# EasyEDA Pro project ProPrj_BrainStimulator-4Channels-Prototype_2025-12-16.epro, board PCB1
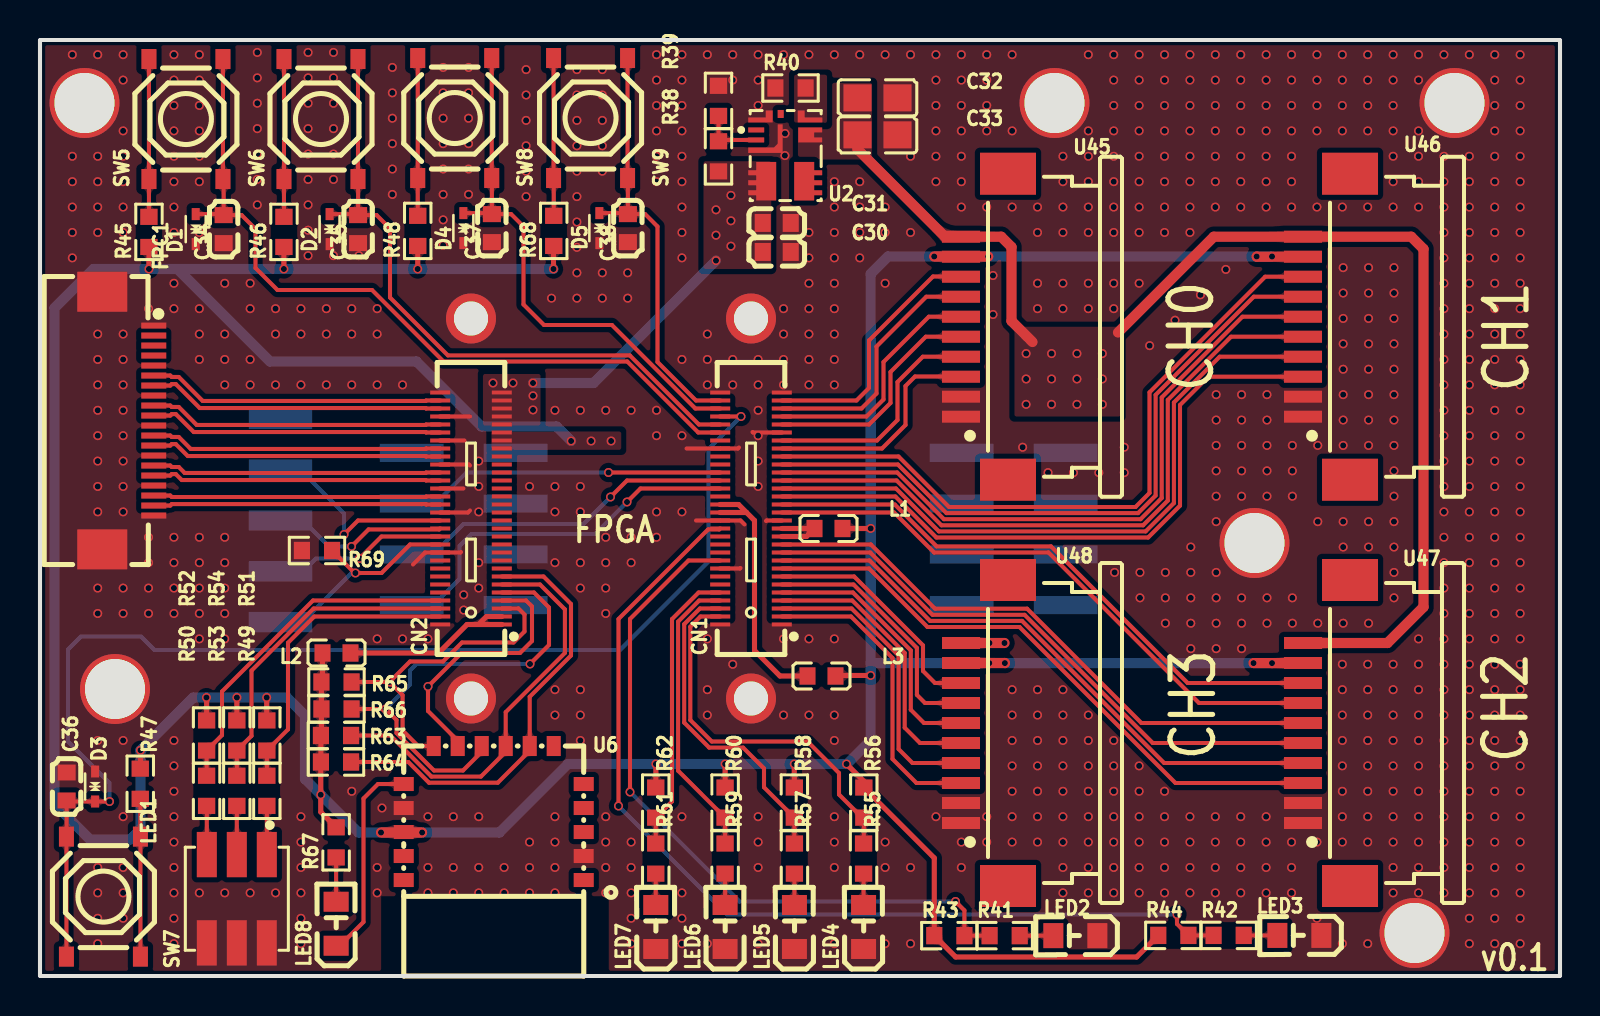
[diagram p5: board, top side]
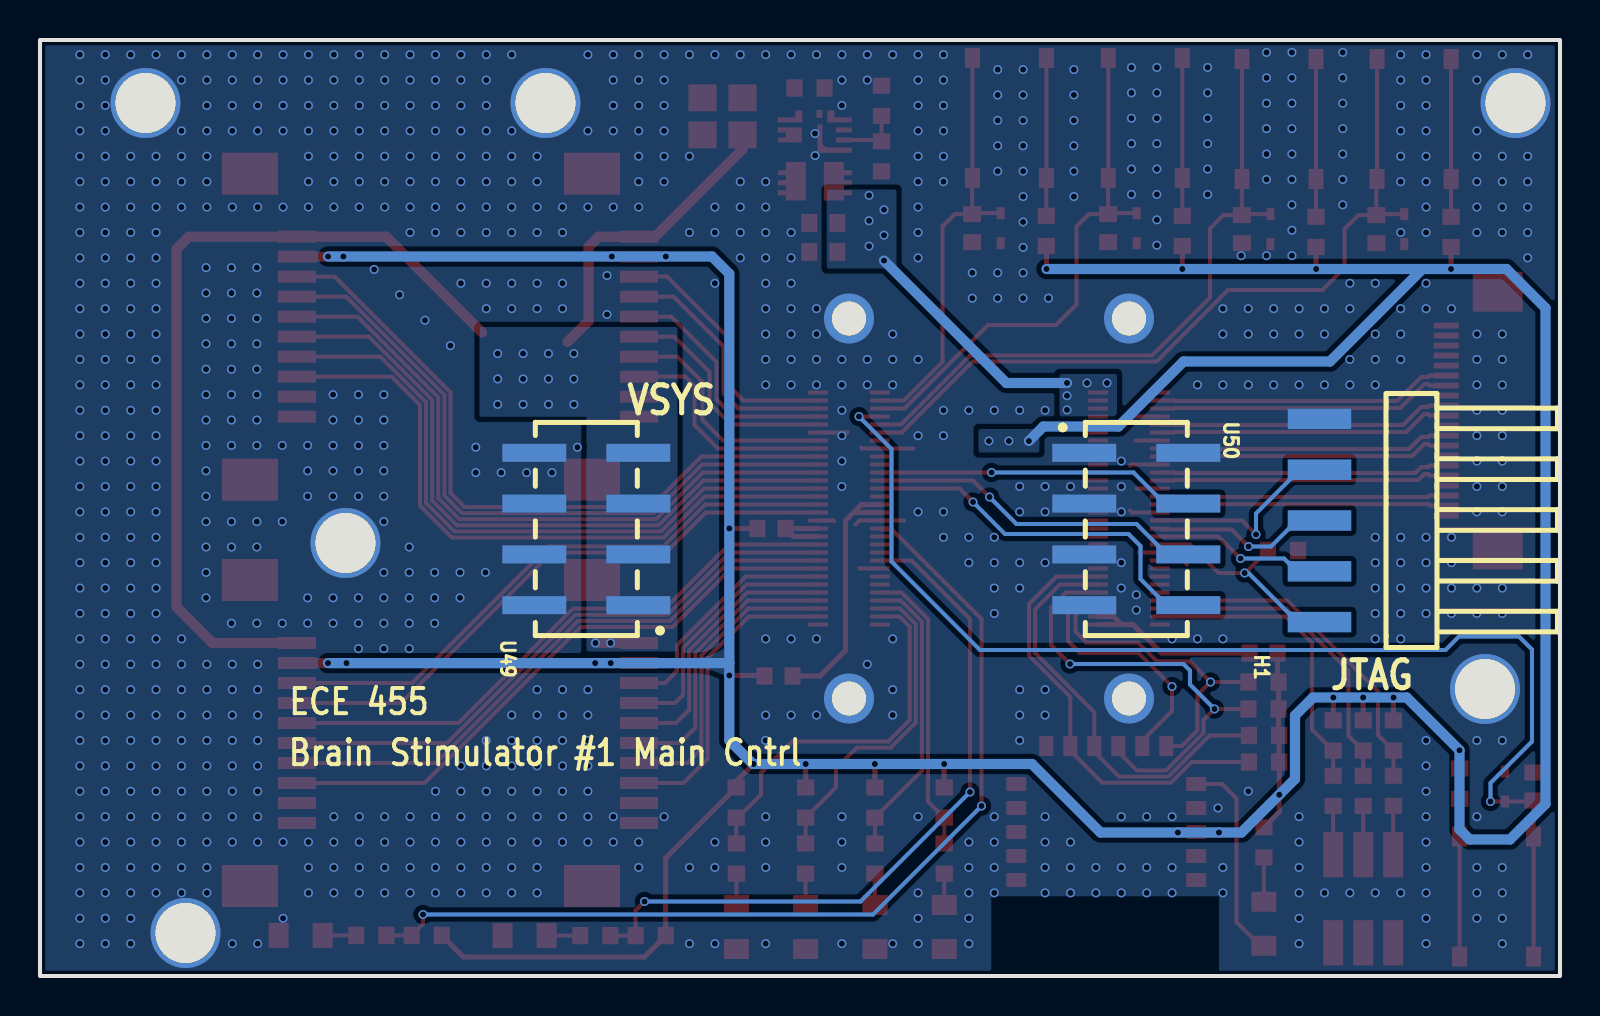
[diagram p6: board, bottom side, seen from below]

Outline 76 x 46.8 mm; copper layers: Top Layer, Inner1, Inner2, Bottom Layer. Coordinates in mm from the lower left corner of the outline.
Outline path: rectangle 0,46.8 76,0
Stack: Top Layer 0.035mm Outer layer thickness 1oz / Dielectric1 0.2104mm 7628 RC49% 8.6mil / Inner1 0.0152mm Inner layer thickness / Dielectric2 1.065mm 1.1mm H/HOZ Copper / Inner2 0.0152mm Inner layer thickness / Dielectric3 0.2104mm 7628 RC49% 8.6mil / Bottom Layer 0.035mm Outer layer thickness 1oz

## Design rules (mm)
net M0_D3_P: M0_D3_
net M0_D3_N: M0_D3_
net M0_D2_P: M0_D2_
net M0_D2_N: M0_D2_
net M0_CK_P: M0_CK_
net M0_CK_N: M0_CK_
net M0_D1_P: M0_D1_
net M0_D1_N: M0_D1_
net M0_D0_P: M0_D0_
net M0_D0_N: M0_D0_
spacing copperThickness1oz (default): track to track 0.102, other pairs 0.152 to 0.3
spacing copperThickness2oz: track to track 0.203, other pairs 0.152 to 0.3
track width copperThickness1oz (default): min 0.127, default 0.254, max 2.54
track width copperThickness2oz: min 0.203, default 0.254, max 2.54
differential pair differentialPair (default): width min 0.127, default 0.254, max 2.54; gap min 0.152, default 0.152
net +5V uses copperRegion1
net GND uses copperRegion1
net VSYS uses copperRegion1
net 3V3 uses copperRegion1
net $1N10 uses copperRegion
net $1N5 uses copperRegion1
pour e532 uses copperRegion1, default

## Placement (name value [footprint] x y rotation side)
C30  22uF  [C0603]  36.84 36.2 180 top
C31  22uF  [C0603]  36.84 37.65 180 top
C32  10uF  [C0805]  41.88 43.91 180 top
C33  100nF  [C0805]  41.88 42.06 180 top
C34  100nF  [C0603]  9.18 37.34 90 top
C35  100nF  [C0603]  15.91 37.34 90 top
C36  100nF  [C0603]  1.33 9.48 270 top
C37  100nF  [C0603]  22.59 37.39 90 top
C38  100nF  [C0603]  29.39 37.39 90 top
CN1  DF40C-60DS-0.4V(51)  [CONN-SMD_DF40C-60DS-0.4V-51]  35.55 23.38 90 top
CN2  DF40C-60DS-0.4V(51)  [CONN-SMD_DF40C-60DS-0.4V-51]  21.55 23.38 90 top
D1  RSB6.8SMT2N  [SOD-523_L1.2-W0.8-LS1.6-BI]  7.79 37.34 90 top
D2  RSB6.8SMT2N  [SOD-523_L1.2-W0.8-LS1.6-BI]  14.48 37.34 90 top
D3  RSB6.8SMT2N  [SOD-523_L1.2-W0.8-LS1.6-BI]  2.76 9.48 270 top
D4  RSB6.8SMT2N  [SOD-523_L1.2-W0.8-LS1.6-BI]  21.17 37.39 90 top
D5  RSB6.8SMT2N  [SOD-523_L1.2-W0.8-LS1.6-BI]  27.97 37.39 90 top
FPC1  FPC-05F-20PH20  [FPC-SMD_20P-P0.50_XUNPU_FPC-05F-20PH20]  4.4 27.77 270 top
H1  HX PZ2.54-1x5P WT  [HDR-SMD_5P-P2.54-H-M-W12.8-N]  12.02 22.78 90 bottom
L1  PZ1608D300-3R0TF  [L0603]  39.42 22.38 180 top
L2  PZ1608D300-3R0TF  [L0603]  14.82 16.15 0 top
L3  PZ1608D300-3R0TF  [L0603]  39.07 15 180 top
LED1  TC5050RGBF08-3CJH-AF53A  [LED-SMD_6P-L5.0-W5.0-TL_TC5050RGBF08]  9.84 3.86 270 top
LED2  GL0805UB01  [LED0805-RD_BLUE]  51.77 2.02 180 top
LED3  GL0805UB01  [LED0805-RD_BLUE]  62.97 2.03 180 top
LED4  GL0805UB01  [LED0805-RD_BLUE]  41.18 2.45 90 top
LED5  GL0805UB01  [LED0805-RD_BLUE]  37.72 2.45 90 top
LED6  GL0805UB01  [LED0805-RD_BLUE]  34.25 2.45 90 top
LED7  GL0805UB01  [LED0805-RD_BLUE]  30.79 2.45 90 top
LED8  GL0805UB01  [LED0805-RD_BLUE]  14.81 2.61 90 top
NOREF  -  [Pad_e1873]  70.72 43.65 0 top
NOREF#2  -  [Pad_e1875]  60.72 21.65 0 top
NOREF#3  -  [Pad_e1764]  35.55 13.88 0 top
NOREF#4  -  [Pad_e1765]  21.55 13.88 0 top
NOREF#5  -  [Pad_e1750]  21.55 32.88 0 top
NOREF#6  -  [Pad_e1872]  50.72 43.65 0 top
NOREF#7  -  [Pad_e1874]  68.72 2.15 0 top
NOREF#8  -  [Pad_e1871]  2.22 43.65 0 top
NOREF#9  -  [Pad_e1876]  3.75 14.35 0 top
NOREF#10  -  [Pad_e1759]  35.55 32.88 0 top
R38  73.2kΩ  [R0603]  33.92 40.98 270 top
R39  10kΩ  [R0603]  33.92 43.76 270 top
R40  18kΩ  [R0603]  37.53 44.4 0 top
R41  49.9kΩ  [R0603]  48.23 2.02 0 top
R42  49.9kΩ  [R0603]  59.43 2.03 0 top
R43  49.9kΩ  [R0603]  45.47 2.02 0 top
R44  49.9kΩ  [R0603]  56.67 2.03 0 top
R45  100Ω  [R0603]  5.45 37.21 90 top
R46  100Ω  [R0603]  12.2 37.21 90 top
R47  100Ω  [R0603]  5.01 9.61 270 top
R48  100Ω  [R0603]  18.89 37.26 90 top
R49  49.9kΩ  [R0603]  11.34 9.26 270 top
R50  49.9kΩ  [R0603]  8.33 9.26 270 top
R51  49.9kΩ  [R0603]  11.34 12.03 270 top
R52  49.9kΩ  [R0603]  8.33 12.03 270 top
R53  49.9kΩ  [R0603]  9.84 9.26 270 top
R54  49.9kΩ  [R0603]  9.84 12.03 270 top
R55  49.9kΩ  [R0603]  41.18 5.87 270 top
R56  49.9kΩ  [R0603]  41.19 8.67 270 top
R57  49.9kΩ  [R0603]  37.72 5.87 270 top
R58  49.9kΩ  [R0603]  37.72 8.67 270 top
R59  49.9kΩ  [R0603]  34.25 5.87 270 top
R60  49.9kΩ  [R0603]  34.25 8.67 270 top
R61  49.9kΩ  [R0603]  30.79 5.87 270 top
R62  49.9kΩ  [R0603]  30.79 8.67 270 top
R63  100kΩ  [R0603]  14.8 12.03 0 top
R64  100kΩ  [R0603]  14.8 10.7 0 top
R65  100kΩ  [R0603]  14.82 14.7 0 top
R66  100kΩ  [R0603]  14.82 13.35 0 top
R67  330Ω  [R0603]  14.81 6.68 90 top
R68  100Ω  [R0603]  25.69 37.26 90 top
R69  5.1kΩ  [R0603]  13.85 21.28 180 top
SW5  TS-1187A-B-A-B  [SW-SMD_4P-L5.1-W5.1-P3.70-LS6.5-TL_H1.5]  7.3 42.85 90 top
SW6  TS-1187A-B-A-B  [SW-SMD_4P-L5.1-W5.1-P3.70-LS6.5-TL_H1.5]  14.05 42.85 90 top
SW7  TS-1187A-B-A-B  [SW-SMD_4P-L5.1-W5.1-P3.70-LS6.5-TL_H1.5]  3.17 3.97 270 top
SW8  TS-1187A-B-A-B  [SW-SMD_4P-L5.1-W5.1-P3.70-LS6.5-TL_H1.5]  20.74 42.9 90 top
SW9  TS-1187A-B-A-B  [SW-SMD_4P-L5.1-W5.1-P3.70-LS6.5-TL_H1.5]  27.53 42.9 90 top
U2  TPSM84338RCJR  [QFN-FCMOD-9_L4.5-W3.3_TPSM84338]  37.16 41.42 0 top
U6  RN4871-V/RM140  [BULETM-SMD_RN4871-V-RM140]  22.69 8.15 180 top
U45  522711069  [FPC-SMD_10P-P1.00_522711069]  47.22 32.46 90 top
U46  522711069  [FPC-SMD_10P-P1.00_522711069]  64.33 32.46 90 top
U47  522711069  [FPC-SMD_10P-P1.00_522711069]  64.33 12.15 90 top
U48  522711069  [FPC-SMD_10P-P1.00_522711069]  47.22 12.15 90 top
U49  HC-PM254-5.0H-2x4PS-02A  [HDR-SMD_8P-P2.54-V-F-R2-C4-S7.2-2]  48.68 22.35 90 bottom
U50  HC-PM254-5.0H-2x4PS-02A  [HDR-SMD_8P-P2.54-V-F-R2-C4-S7.2-2]  21.19 22.35 270 bottom

## Footprints (pads in the part's own frame, mm; a bottom-side part is the same pattern mirrored in y, then rotated)
BULETM-SMD_RN4871-V-RM140
  rect 1x0.7 smd: 1(-4.5,3.35) 2(-4.5,2.15) 3(-4.5,0.95) 4(-4.5,-0.25) 5(-4.5,-1.45) 12(4.5,-1.45) 13(4.5,-0.25) 14(4.5,0.95) 15(4.5,2.15) 16(4.5,3.35)
  rect 0.7x1 smd: 6(-3,-3.35) 7(-1.8,-3.35) 8(-0.6,-3.35) 9(0.6,-3.35) 10(1.8,-3.35) 11(3,-3.35)
C0603
  rect 0.8x0.9 smd: 1(-0.7,0) 2(0.7,0)
C0805
  rect 1.41x1.35 smd: 1(-1,0) 2(1,0)
CONN-SMD_DF40C-60DS-0.4V-51
  rect 0.2x1 smd: 1(-5.8,-1.54) 2(-5.4,-1.54) 3(-5,-1.54) 4(-4.6,-1.54) 5(-4.2,-1.54) 6(-3.8,-1.54) 7(-3.4,-1.54) 8(-3,-1.54) 9(-2.6,-1.54) 10(-2.2,-1.54) 11(-1.8,-1.54) 12(-1.4,-1.54) 13(-1,-1.54) 14(-0.6,-1.54) 15(-0.2,-1.54) 16(0.2,-1.54) 17(0.6,-1.54) 18(1,-1.54) 19(1.4,-1.54) 20(1.8,-1.54) 21(2.2,-1.54) 22(2.6,-1.54) 23(3,-1.54) 24(3.4,-1.54) 25(3.8,-1.54) 26(4.2,-1.54) 27(4.6,-1.54) 28(5,-1.54) 29(5.4,-1.54) 30(5.8,-1.54) 31(5.8,1.54) 32(5.4,1.54) 33(5,1.54) 34(4.6,1.54) 35(4.2,1.54) 36(3.8,1.54) 37(3.4,1.54) 38(3,1.54) 39(2.6,1.54) 40(2.2,1.54) 41(1.8,1.54) 42(1.4,1.54) 43(1,1.54) 44(0.6,1.54) 45(0.2,1.54) 46(-0.2,1.54) 47(-0.6,1.54) 48(-1,1.54) 49(-1.4,1.54) 50(-1.8,1.54) 51(-2.2,1.54) 52(-2.6,1.54) 53(-3,1.54) 54(-3.4,1.54) 55(-3.8,1.54) 56(-4.2,1.54) 57(-4.6,1.54) 58(-5,1.54) 59(-5.4,1.54) 60(-5.8,1.54)
FPC-SMD_10P-P1.00_522711069
  rect 0.6x1.9 smd: 1(-4.5,1.175) 2(-3.5,1.175) 3(-2.5,1.175) 4(-1.5,1.175) 5(-0.5,1.175) 6(0.5,1.175) 7(1.5,1.175) 8(2.5,1.175) 9(3.5,1.175) 10(4.5,1.175)
  rect 2.1x2.8 smd: MP1(-7.65,-1.175) MP2(7.65,-1.175)
FPC-SMD_20P-P0.50_XUNPU_FPC-05F-20PH20
  rect 0.3x1.25 smd: 1(-4.75,1.288) 2(-4.25,1.288) 3(-3.75,1.288) 4(-3.25,1.288) 5(-2.75,1.288) 6(-2.25,1.288) 7(-1.75,1.288) 8(-1.25,1.288) 9(-0.75,1.288) 10(-0.25,1.288) 11(0.25,1.288) 12(0.75,1.288) 13(1.25,1.288) 14(1.75,1.288) 15(2.25,1.288) 16(2.75,1.288) 17(3.25,1.288) 18(3.75,1.288) 19(4.25,1.288) 20(4.75,1.288)
  rect 2x2.5 smd: 21(6.44,-1.288) 22(-6.44,-1.288)
HDR-SMD_5P-P2.54-H-M-W12.8-N
  rect 1.02x3.17 smd: 1(-5.08,0) 2(-2.54,0) 3(0,0) 4(2.54,0) 5(5.08,0)
HDR-SMD_8P-P2.54-V-F-R2-C4-S7.2-2
  rect 0.9x3.2 smd: 1(-3.81,-2.6) 2(-3.81,2.6) 3(-1.27,-2.6) 4(-1.27,2.6) 5(1.27,-2.6) 6(1.27,2.6) 7(3.81,-2.6) 8(3.81,2.6)
L0603
  rect 0.8x0.864 smd: 1(-0.7,0) 2(0.7,0)
LED0805-RD_BLUE
  rect 1x1.25 smd: 1(-1.1,0) 2(1.1,0)
LED-SMD_6P-L5.0-W5.0-TL_TC5050RGBF08
  rect 2.265x1 smd: 1(-2.208,1.5) 2(-2.208,0) 3(-2.208,-1.5) 4(2.208,-1.5) 5(2.208,0) 6(2.208,1.5)
Pad_e1750
  round 2.5 hole 1.7: 1(0,0)
Pad_e1759
  round 2.5 hole 1.7: 1(0,0)
Pad_e1764
  round 2.5 hole 1.7: 1(0,0)
Pad_e1765
  round 2.5 hole 1.7: 1(0,0)
Pad_e1871
  round 3.5 hole 3: 1(0,0)
Pad_e1872
  round 3.5 hole 3: 1(0,0)
Pad_e1873
  round 3.5 hole 3: 1(0,0)
Pad_e1874
  round 3.5 hole 3: 1(0,0)
Pad_e1875
  round 3.5 hole 3: 1(0,0)
Pad_e1876
  round 3.5 hole 3: 1(0,0)
QFN-FCMOD-9_L4.5-W3.3_TPSM84338
  rect 0.8x0.25 smd: 1(-1.35,0.881) 2(-1.35,0.382)
  custom 1.725x1.431 smd: 3(-0.887,0.448)
  custom 1.4x1.925 smd: 4(-1.05,-1.681) 5(1.25,-1.681)
  custom 1.2x0.75 smd: 6(1.35,0.631)
  custom 1.236x0.6 smd: 7(1.343,1.556)
  rect 0.3x0.4 smd: 8(-0.125,1.681)
  custom 1.225x0.6 smd: 9(-1.137,1.556)
R0603
  rect 0.806x0.864 smd: 1(-0.753,0) 2(0.753,0)
SOD-523_L1.2-W0.8-LS1.6-BI
  rect 0.6x0.4 smd: 1(-0.75,0) 2(0.75,0)
SW-SMD_4P-L5.1-W5.1-P3.70-LS6.5-TL_H1.5
  rect 1x0.75 smd: 1(-3,1.85) 2(3,1.85) 3(-3,-1.85) 4(3,-1.85)

## Nets
As in the schematic, except:
GND: C30.1 C31.1 C32.1 C33.1 C34.1 C35.1 C36.1 C37.1 C38.1 CN1.1 CN1.14 CN1.25 CN1.30 CN1.31 CN1.38 CN1.47 CN1.53 CN1.60 CN2.31 CN2.34 CN2.37 CN2.40 CN2.43 CN2.46 CN2.51 CN2.60 D1.1 D2.1 D3.1 D4.1 D5.1 FPC1.1 FPC1.5 FPC1.8 FPC1.11 FPC1.14 FPC1.17 FPC1.20 FPC1.21 FPC1.22 H1.5 LED1.4 LED1.5 LED1.6 LED2.1 LED3.1 LED4.1 LED5.1 LED6.1 LED7.1 NOREF.1 NOREF#2.1 NOREF#3.1 NOREF#4.1 NOREF#5.1 NOREF#6.1 NOREF#7.1 NOREF#8.1 NOREF#9.1 NOREF#10.1 R39.1 R40.1 R69.2 U2.3 U2.9 U6.2 U6.13 U45.1 U45.2 U46.1 U46.2 U47.1 U47.2 U48.1 U48.2 U49.2 U49.4 U49.6 U49.8 U50.1 U50.2 U50.3 U50.5 U50.7

Pads without a net: CN1 37 39 40 44 49 50 51; CN2 19 20 21 22; FPC1 2 3 4; U2 1 5 8; U6 1 3 4 5 6 15 16; U45 MP1 MP2; U46 MP1 MP2; U47 MP1 MP2; U48 MP1 MP2

## Via types
v1: diameter 0.45, hole 0.305, Top Layer to Bottom Layer, 911 vias

## Routing (per net, layer and track width the routed paths; a pad name or vN(x,y) marks a point on that pad's centre or on a via; arc(x,y) is an arc through that point)
3V3: length 249.9
  Top Layer w0.254: v1(30.79,10.6) 30.79,9.43 R62.1 ; v1(40.32,10.6) 41.19,9.73 41.19,9.42 44.71,5.9 R43.1 45.78,0.95 54.83,0.95 R44.1 ; L1.1 41.53,22.38 v1(41.53,22.38) ; R60.1 34.26,9.43 v1(34.26,10.6) ; R48.1 18.89,35.35 v1(18.88,35.35) ; R52.1 8.33,13.92 v1(8.32,13.93) ; v1(5.02,11.29) 5.02,10.38 R47.1 ; R51.1 11.33,12.79 v1(11.33,13.93) ; 37.72,9.42 37.72,9.43 v1(37.72,10.6) ; L3.1 39.8,15.03 v1(41.53,15.03) ; R54.1 9.84,13.92 v1(9.84,13.93) ; L2.1 14.12,14.75 R65.1 R66.1 14.07,12.05 R63.1 R64.1 14.04,10.69 v1(14.04,9.06) 14.04,8.2 R67.2 ; R68.1 25.67,36.49 v1(25.67,35.35) ; R46.1 12.19,36.45 v1(12.19,35.35) ; 5.45,36.45 v1(5.45,35.35)
  Top Layer w0.508: U47.9 63.15,15.65 v1(61.6,15.65) v1(60.68,15.65) ; v1(48.24,15.65) 48.24,15.65 U48.9 ; v1(44.71,35.98) v1(47.41,35.98) ; U46.9 60.84,35.96 v1(60.83,35.98) ; v1(19.11,7.18) v1(17.05,7.18)
  Bottom Layer w0.508: v1(61.6,35.98) v1(60.83,35.98) v1(47.41,35.98) v1(44.71,35.98) 42.4,35.98 41.53,35.11 v1(41.53,22.38) 41.53,15.65 ; v1(25.67,35.35) v1(18.88,35.35) v1(12.19,35.35) 6.88,35.35 ; 41.53,15.65 v1(41.53,15.03) 41.53,11.78 40.35,10.6 v1(37.72,10.6) v1(34.26,10.6) v1(30.79,10.6) 26.4,10.6 22.97,7.18 v1(19.11,7.18) v1(17.05,7.18) 15.92,7.18 v1(14.04,9.06) 13.25,9.85 13.25,13.03 12.35,13.93 v1(11.33,13.93) v1(9.84,13.93) v1(8.32,13.93) 7.66,13.93 v1(5.02,11.29) 5.02,7.33 4.52,6.83 2.5,6.83 0.72,8.6 0.72,33.4 2.67,35.35 v1(5.45,35.35) 6.88,35.35 ; 41.53,15.65 v1(47.46,15.65) v1(48.24,15.65) v1(60.68,15.65) v1(61.6,15.65) ; 6.88,35.35 11.5,30.73 18.82,30.73 22.07,27.48 25.83,27.48 v1(26.56,26.75)
  vias: v1(27.56,26.75) v1(28.56,26.75)
+5V: length 11.7
  Bottom Layer w0.508: v1(33.8,35.77) 27.68,29.65 v1(24.65,29.65)
  vias: v1(22.65,29.65) v1(23.65,29.65) v1(24.65,29.01) v1(24.65,28.3) v1(33.8,38.31) v1(33.8,37.04) v1(34.55,39.03) v1(34.55,37.76) v1(34.55,36.49)
GND: length 18
  Top Layer w0.203: CN1.25 35.65,27.18 35.62,27.2 ; CN1.53 35,20.38 35.03,20.4 ; 32.8,22.78 CN1.47 35.03,22.78 35.22,22.58 ; 21.05,21.2 21.03,21.18 CN2.51 19.25,21.18 18.65,20.58 ; 21.5,25.53 21.45,25.58 CN2.40 ; CN2.46 21.4,23.18 21.5,23.28 ; 34.95,26.43 34.9,26.38 CN1.38 32.32,26.38 ; CN2.37 21.22,26.78 ; 36.3,22.75 36.32,22.78 CN1.14 ; CN2.34 21.5,27.98 ; CN2.43 21.17,24.38
  vias: v1(1.62,46.07) v1(1.62,40.99) v1(1.62,39.72) v1(1.62,38.45) v1(1.62,37.18) v1(1.62,35.91) v1(2.89,46.07) v1(2.89,40.99) v1(2.89,39.72) v1(2.89,38.45) v1(2.89,37.18) v1(2.89,32.1) v1(2.89,30.83) v1(2.89,29.56) v1(2.89,28.29) v1(2.89,27.02) v1(2.89,25.75) v1(2.89,24.48) v1(2.89,23.21) v1(2.89,19.4) v1(2.89,18.13) v1(2.89,11.78) v1(2.89,5.43) v1(2.89,4.16) v1(2.89,2.89) v1(2.89,1.62) v1(4.16,46.07) v1(4.16,44.8) v1(4.16,42.26) v1(4.16,40.99) v1(4.16,39.72) v1(4.16,38.45) v1(4.16,37.18) v1(4.16,32.1) v1(4.16,30.83) v1(4.16,29.56) v1(4.16,28.29) v1(4.16,27.02) v1(4.16,25.75) v1(4.16,24.48) v1(4.16,23.21) v1(4.16,19.4) v1(4.16,18.13) v1(4.16,11.78) v1(4.16,7.97) v1(4.16,5.43) v1(4.16,4.16) v1(4.16,2.89) v1(5.43,33.37) v1(5.43,21.94) v1(5.43,20.67) v1(5.43,19.4) v1(5.43,18.13) v1(6.7,46.07) v1(6.7,44.8) v1(6.7,43.53) v1(6.7,42.26) v1(6.7,40.99) v1(6.7,39.72) v1(6.7,38.45) v1(6.7,37.18) v1(6.7,34.64) v1(6.7,33.37) v1(6.7,21.94) v1(6.7,20.67) v1(6.7,19.4) v1(6.7,18.13) v1(6.7,11.78) v1(6.7,10.51) v1(6.7,9.24) v1(6.7,7.97) v1(6.7,6.7) v1(6.7,5.43) v1(6.7,4.16) v1(6.7,2.89) v1(6.7,1.62) v1(7.97,46.07) v1(7.97,44.8) v1(7.97,43.53) v1(7.97,42.26) v1(7.97,40.99) v1(7.97,39.72) v1(7.97,37.18) v1(7.97,33.37) v1(7.97,32.1) v1(7.97,30.83) v1(7.97,21.94) v1(7.97,20.67) v1(7.97,19.4) v1(7.97,18.13) v1(7.97,16.86) v1(7.97,4.16) v1(9.24,34.64) v1(9.24,32.1) v1(9.24,30.83) v1(9.24,29.56) v1(9.24,21.94) v1(9.24,20.67) v1(9.24,19.4) v1(9.24,18.13) v1(9.24,16.86) v1(9.24,4.16) v1(10.51,34.64) v1(10.51,33.37) v1(10.51,30.83) v1(10.51,29.56) v1(10.51,4.16) v1(10.86,46.18) v1(10.86,44.91) v1(10.86,43.64) v1(10.86,42.37) v1(10.86,41.1) v1(10.86,39.83) v1(10.86,38.56) v1(11.78,33.37) v1(11.78,32.1) v1(11.78,29.56) v1(11.78,4.16) v1(13.05,33.37) v1(13.05,32.1) v1(13.05,29.56) v1(13.05,7.97) v1(13.05,6.7) v1(13.05,5.43) v1(13.05,4.16) v1(13.05,2.89) v1(13.05,1.62) v1(13.4,46.18) v1(13.4,44.91) v1(13.4,43.64) v1(13.4,42.37) v1(13.4,41.1) v1(13.4,39.83) v1(13.4,38.56) v1(13.4,37.29) v1(13.4,36.02) v1(14.32,33.37) v1(14.32,32.1) v1(14.32,29.56) v1(14.67,46.18) v1(14.67,44.91) v1(14.67,43.64) v1(14.67,42.37) v1(14.67,41.1) v1(14.67,39.83) v1(14.67,36.02) v1(15.59,33.37) v1(15.59,32.1) v1(15.59,29.56) v1(15.59,9.24) v1(15.94,36.02) v1(16.86,33.37) v1(16.86,32.1) v1(16.86,29.56) v1(16.86,16.86) v1(16.86,5.43) v1(16.86,4.16) v1(17.1,8.4) v1(17.62,45.43) v1(17.62,44.16) v1(17.62,42.89) v1(17.62,41.62) v1(17.62,40.35) v1(17.62,39.08) v1(18.13,29.56) v1(18.13,16.86) v1(19.4,16.86) v1(19.4,7.97) v1(19.4,5.43) v1(19.4,4.16) v1(20.16,45.43) v1(20.16,44.16) v1(20.16,42.89) v1(20.16,41.62) v1(20.16,40.35) v1(20.16,39.08) v1(20.16,37.81) v1(20.16,36.54) v1(20.67,7.97) v1(20.67,5.43) v1(20.67,4.16) v1(21.19,19.06) v1(21.19,18.3) v1(21.43,45.43) v1(21.43,44.16) v1(21.43,42.89) v1(21.43,41.62) v1(21.43,40.35) v1(21.43,39.08) v1(21.94,25.75) v1(21.94,24.48) v1(21.94,23.21) v1(21.94,20.67) v1(21.94,19.4) v1(21.94,7.97) v1(21.94,5.43) v1(21.94,4.16) v1(23.21,5.43) v1(23.21,4.16) v1(24.31,45.32) v1(24.31,44.05) v1(24.31,42.78) v1(24.31,41.51) v1(24.31,40.24) v1(24.31,38.97) v1(24.48,24.48) v1(24.48,6.7) v1(24.48,5.43) v1(24.48,4.16) v1(25.57,33.89) v1(25.75,28.29) v1(25.75,24.48) v1(25.75,23.21) v1(25.75,20.67) v1(25.75,14.32) v1(25.75,13.05) v1(25.75,7.97) v1(25.75,6.7) v1(25.75,5.43) v1(25.75,4.16) v1(26.84,45.32) v1(26.84,44.05) v1(26.84,42.78) v1(26.84,41.51) v1(26.84,40.24) v1(26.84,38.97) v1(26.84,37.7) v1(26.84,36.43) v1(26.84,35.16) v1(26.84,33.89) v1(27.02,28.29) v1(27.02,24.48) v1(27.02,23.21) v1(27.02,20.67) v1(27.02,19.4) v1(27.02,14.32) v1(27.02,13.05) v1(27.02,11.78) v1(28.11,45.32) v1(28.11,44.05) v1(28.11,42.78) v1(28.11,41.51) v1(28.11,40.24) v1(28.11,35.16) v1(28.11,33.89) v1(28.29,28.29) v1(28.29,21.94) v1(28.29,20.67) v1(28.29,19.4) v1(28.29,18.13) v1(28.29,7.97) v1(28.29,6.7) v1(28.29,5.43) v1(28.29,4.16) v1(29.38,35.16) v1(29.38,33.89) v1(29.56,28.29) v1(29.56,21.94) v1(29.56,20.67) v1(29.56,6.7) v1(29.56,5.43) v1(29.56,4.16) v1(29.56,2.89) v1(29.56,1.62) v1(30.83,46.07) v1(30.83,44.8) v1(30.83,43.53) v1(30.83,42.26) v1(30.83,40.99) v1(30.83,39.72) v1(30.83,28.29) v1(30.83,27.02) v1(30.83,23.21) v1(30.83,21.94) v1(32.1,46.07) v1(32.1,44.8) v1(32.1,43.53) v1(32.1,42.26) v1(32.1,40.99) v1(32.1,39.72) v1(32.1,38.45) v1(32.1,37.18) v1(32.1,35.91) v1(32.1,30.83) v1(32.1,27.02) v1(32.1,23.21) v1(32.1,7.97) v1(32.1,4.16) v1(32.1,2.89) v1(32.1,1.62) v1(33.37,46.07) v1(33.37,32.1) v1(33.37,30.83) v1(33.37,29.56) v1(33.37,16.86) v1(33.37,14.32) v1(33.37,13.05) v1(33.37,1.62) v1(34.64,46.07) v1(34.64,44.8) v1(34.64,30.83) v1(34.64,29.56) v1(34.64,15.59) v1(35.91,46.07) v1(35.91,44.8) v1(35.91,43.53) v1(35.91,30.83) v1(35.91,29.56) v1(35.91,28.29) v1(35.91,27.02) v1(35.91,25.75) v1(35.91,24.48) v1(35.91,7.97) v1(35.91,6.7) v1(35.91,5.43) v1(35.91,1.62) v1(37.18,46.07) v1(37.25,42.12) v1(37.25,41.02) v1(37.18,33.37) v1(37.18,32.1) v1(37.18,30.83) v1(37.18,29.56) v1(37.18,16.86) v1(37.18,13.05) v1(38.45,46.07) v1(38.45,37.18) v1(38.45,35.91) v1(38.45,34.64) v1(38.45,33.37) v1(38.45,32.1) v1(38.45,30.83) v1(38.45,29.56) v1(38.45,16.86) v1(38.45,13.05) v1(39.72,46.07) v1(39.72,39.72) v1(39.72,38.45) v1(39.72,37.18) v1(39.72,35.91) v1(39.72,34.64) v1(39.72,33.37) v1(39.72,32.1) v1(39.72,30.83) v1(39.72,29.56) v1(39.72,16.86) v1(39.72,13.05) v1(39.72,11.78) v1(39.72,7.97) v1(39.72,6.7) v1(39.72,5.43) v1(39.72,1.62) v1(40.99,46.07) v1(40.99,39.72) v1(40.99,38.45) v1(40.99,37.18) v1(40.99,35.91) v1(42.26,46.07) v1(42.26,38.45) v1(42.26,37.18) v1(42.26,34.64) v1(42.26,6.7) v1(42.26,5.43) v1(42.26,1.62) v1(43.53,46.07) v1(43.53,40.99) v1(43.53,37.18) v1(43.53,5.43) v1(43.53,1.62) v1(44.8,46.07) v1(44.8,44.8) v1(44.8,43.53) v1(44.8,42.26) v1(44.8,40.99) v1(44.8,39.72) v1(44.8,7.97) v1(46.07,46.07) v1(46.07,44.8) v1(46.07,43.53) v1(46.07,42.26) v1(46.07,40.99) v1(46.07,39.72) v1(46.07,38.45) v1(46.07,6.7) v1(46.07,5.43) v1(47.34,46.07) v1(47.34,44.8) v1(47.34,43.53) v1(47.34,42.26) v1(47.34,38.45) v1(47.34,7.97) v1(47.34,6.7) v1(47.65,35.03) v1(47.65,33.08) v1(48.61,46.07) v1(48.61,42.26) v1(48.61,38.45) v1(48.61,14.32) v1(48.61,13.05) v1(48.61,11.78) v1(48.61,10.51) v1(48.61,9.24) v1(48.61,7.97) v1(48.61,6.7) v1(49.13,26.44) v1(49.88,38.45) v1(49.88,37.18) v1(49.88,34.64) v1(49.88,33.37) v1(49.88,14.32) v1(49.88,13.05) v1(49.88,11.78) v1(49.88,10.51) v1(49.88,9.24) v1(49.88,7.97) v1(49.88,6.7) v1(50.4,25.17) v1(51.15,40.99) v1(51.15,39.72) v1(51.15,38.45) v1(51.15,37.18) v1(51.15,34.64) v1(51.15,33.37) v1(51.15,14.32) v1(51.15,13.05) v1(51.15,11.78) v1(51.15,10.51) v1(51.15,9.24) v1(51.15,7.97) v1(51.15,6.7) v1(51.15,5.43) v1(51.15,4.16) v1(51.67,25.17) v1(52.42,46.07) v1(52.42,42.26) v1(52.42,40.99) v1(52.42,39.72) v1(52.42,38.45) v1(52.42,37.18) v1(52.42,34.64) v1(52.42,33.37) v1(52.42,13.05) v1(52.42,11.78) v1(52.42,10.51) v1(52.42,9.24) v1(52.42,7.97) v1(52.42,6.7) v1(52.42,5.43) v1(52.42,4.16) v1(52.94,25.17) v1(53.69,46.07) v1(53.69,44.8) v1(53.69,43.53) v1(53.69,42.26) v1(53.69,40.99) v1(53.69,39.72) v1(53.69,38.45) v1(53.69,37.18) v1(53.69,34.64) v1(53.69,33.37) v1(53.73,20.18) v1(53.69,11.78) v1(53.69,10.51) v1(53.69,9.24) v1(53.69,7.97) v1(53.69,6.7) v1(53.69,5.43) v1(53.69,4.16) v1(54.21,26.44) v1(54.21,25.17) v1(54.96,46.07) v1(54.96,44.8) v1(54.96,43.53) v1(54.96,42.26) v1(54.96,40.99) v1(54.96,39.72) v1(54.96,38.45) v1(54.96,37.18) v1(54.96,34.64) v1(54.96,10.51) v1(54.96,9.24) v1(54.96,7.97) v1(54.96,6.7) v1(54.96,5.43) v1(54.96,4.16) v1(55,20.18) v1(55,18.91) v1(55.48,31.52) v1(56.23,46.07) v1(56.23,44.8) v1(56.23,43.53) v1(56.23,42.26) v1(56.23,40.99) v1(56.23,39.72) v1(56.23,38.45) v1(56.23,37.18) v1(56.27,20.18) v1(56.27,18.91) v1(56.27,17.64) v1(56.23,9.24) v1(56.23,7.97) v1(56.23,6.7) v1(56.23,5.43) v1(56.23,4.16) v1(56.75,32.79) v1(57.5,46.07) v1(57.5,44.8) v1(57.5,43.53) v1(57.5,42.26) v1(57.5,40.99) v1(57.5,39.72) v1(57.5,38.45) v1(57.5,37.18) v1(57.54,21.45) v1(57.54,20.18) v1(57.54,18.91) v1(57.54,17.64) v1(57.54,16.37) v1(57.5,7.97) v1(57.5,6.7) v1(57.5,5.43) v1(57.5,4.16) v1(58.02,34.06) v1(58.77,46.07) v1(58.77,44.8) v1(58.77,43.53) v1(58.77,42.26) v1(58.77,40.99) v1(58.77,39.72) v1(58.77,38.45) v1(58.77,7.97) v1(58.77,6.7) v1(58.77,5.43) v1(58.77,4.16) v1(58.81,29.07) v1(58.81,27.8) v1(58.81,26.53) v1(58.81,25.26) v1(58.81,23.99) v1(58.81,22.72) v1(58.81,20.18) v1(58.81,18.91) v1(58.81,17.64) v1(58.81,16.37) v1(59.29,35.33) v1(60.04,46.07) v1(60.04,44.8) v1(60.04,43.53) v1(60.04,42.26) v1(60.04,40.99) v1(60.04,39.72) v1(60.04,38.45) v1(60.04,7.97) v1(60.04,6.7) v1(60.04,5.43) v1(60.04,4.16) v1(60.08,29.07) v1(60.08,27.8) v1(60.08,26.53) v1(60.08,25.26) v1(60.08,23.99) v1(60.08,18.91) v1(60.08,17.64) v1(60.08,16.37) v1(61.31,46.07) v1(61.31,44.8) v1(61.31,43.53) v1(61.31,42.26) v1(61.31,40.99) v1(61.31,39.72) v1(61.31,38.45) v1(61.35,29.07) v1(61.35,27.8) v1(61.35,26.53) v1(61.35,25.26) v1(61.35,23.99) v1(61.35,18.91) v1(61.35,17.64) v1(61.31,7.97) v1(61.31,6.7) v1(61.31,5.43) v1(61.31,4.16) v1(62.58,46.07) v1(62.58,44.8) v1(62.58,43.53) v1(62.58,42.26) v1(62.58,40.99) v1(62.58,39.72) v1(62.58,38.45) v1(62.62,26.53) v1(62.62,25.26) v1(62.62,23.99) v1(62.62,18.91) v1(62.62,17.64) v1(62.58,6.7) v1(62.58,5.43) v1(62.58,4.16) v1(63.85,46.07) v1(63.85,44.8) v1(63.85,43.53) v1(63.85,42.26) v1(63.85,38.45) v1(63.85,6.7) v1(63.85,2.89) v1(63.89,26.53) v1(63.89,22.72) v1(63.89,17.64) v1(65.12,46.07) v1(65.12,44.8) v1(65.12,43.53) v1(65.12,42.26) v1(65.12,38.45) v1(65.16,35.42) v1(65.16,34.15) v1(65.16,32.88) v1(65.16,31.61) v1(65.16,30.34) v1(65.16,29.07) v1(65.16,27.8) v1(65.16,26.53) v1(65.16,22.72) v1(65.16,21.45) v1(65.16,17.64) v1(65.12,15.59) v1(65.12,14.32) v1(65.12,13.05) v1(65.12,11.78) v1(65.12,10.51) v1(65.12,9.24) v1(65.12,7.97) v1(65.12,6.7) v1(65.12,1.62) v1(66.39,46.07) v1(66.39,44.8) v1(66.39,43.53) v1(66.39,42.26) v1(66.39,38.45) v1(66.43,35.42) v1(66.43,34.15) v1(66.43,32.88) v1(66.43,31.61) v1(66.43,30.34) v1(66.43,29.07) v1(66.43,27.8) v1(66.43,26.53) v1(66.43,22.72) v1(66.43,21.45) v1(66.43,17.64) v1(66.39,15.59) v1(66.39,14.32) v1(66.39,13.05) v1(66.39,11.78) v1(66.39,10.51) v1(66.39,9.24) v1(66.39,7.97) v1(66.39,6.7) v1(66.39,1.62) v1(67.66,46.07) v1(67.66,44.8) v1(67.66,43.53) v1(67.66,42.26) v1(67.66,40.99) v1(67.66,39.72) v1(67.66,38.45) v1(67.66,15.59) v1(67.66,14.32) v1(67.66,13.05) v1(67.66,11.78) v1(67.66,10.51) v1(67.66,9.24) v1(67.66,7.97) v1(67.66,6.7) v1(67.66,5.43) v1(67.66,4.16) v1(67.7,35.42) v1(67.7,34.15) v1(67.7,32.88) v1(67.7,31.61) v1(67.7,30.34) v1(67.7,29.07) v1(67.7,27.8) v1(67.7,26.53) v1(67.7,25.26) v1(67.7,23.99) v1(67.7,22.72) v1(67.7,21.45) v1(67.7,20.18) v1(67.7,18.91) v1(68.93,46.07) v1(68.93,44.8) v1(68.93,42.26) v1(68.93,40.99) v1(68.93,39.72) v1(68.93,38.45) v1(68.93,16.86) v1(68.93,15.59) v1(68.93,14.32) v1(68.93,13.05) v1(68.93,11.78) v1(68.93,10.51) v1(68.93,9.24) v1(68.93,7.97) v1(68.93,6.7) v1(68.93,5.43) v1(68.93,4.16) v1(70.2,46.07) v1(70.2,40.99) v1(70.2,39.72) v1(70.2,38.45) v1(70.2,37.18) v1(70.2,35.91) v1(70.2,34.64) v1(70.2,33.37) v1(70.2,32.1) v1(70.2,30.83) v1(70.2,29.56) v1(70.2,28.29) v1(70.2,27.02) v1(70.2,25.75) v1(70.2,24.48) v1(70.2,23.21) v1(70.2,21.94) v1(70.2,20.67) v1(70.2,19.4) v1(70.2,18.13) v1(70.2,16.86) v1(70.2,15.59) v1(70.2,14.32) v1(70.2,13.05) v1(70.2,11.78) v1(70.2,10.51) v1(70.2,9.24) v1(70.2,7.97) v1(70.2,6.7) v1(70.2,5.43) v1(70.2,4.16) v1(71.47,46.07) v1(71.47,40.99) v1(71.47,39.72) v1(71.47,38.45) v1(71.47,37.18) v1(71.47,35.91) v1(71.47,34.64) v1(71.47,33.37) v1(71.47,32.1) v1(71.47,30.83) v1(71.47,29.56) v1(71.47,28.29) v1(71.47,27.02) v1(71.47,25.75) v1(71.47,24.48) v1(71.47,23.21) v1(71.47,21.94) v1(71.47,20.67) v1(71.47,19.4) v1(71.47,18.13) v1(71.47,16.86) v1(71.47,15.59) v1(71.47,14.32) v1(71.47,13.05) v1(71.47,11.78) v1(71.47,10.51) v1(71.47,9.24) v1(71.47,7.97) v1(71.47,6.7) v1(71.47,5.43) v1(71.47,4.16) v1(71.47,2.89) v1(71.47,1.62) v1(72.74,46.07) v1(72.74,44.8) v1(72.74,43.53) v1(72.74,42.26) v1(72.74,40.99) v1(72.74,39.72) v1(72.74,38.45) v1(72.74,37.18) v1(72.74,35.91) v1(72.74,34.64) v1(72.74,33.37) v1(72.74,32.1) v1(72.74,30.83) v1(72.74,29.56) v1(72.74,28.29) v1(72.74,27.02) v1(72.74,25.75) v1(72.74,24.48) v1(72.74,23.21) v1(72.74,21.94) v1(72.74,20.67) v1(72.74,19.4) v1(72.74,18.13) v1(72.74,16.86) v1(72.74,15.59) v1(72.74,14.32) v1(72.74,13.05) v1(72.74,11.78) v1(72.74,10.51) v1(72.74,9.24) v1(72.74,7.97) v1(72.74,6.7) v1(72.74,5.43) v1(72.74,4.16) v1(72.74,2.89) v1(72.74,1.62) v1(74.01,46.07) v1(74.01,44.8) v1(74.01,43.53) v1(74.01,42.26) v1(74.01,40.99) v1(74.01,39.72) v1(74.01,38.45) v1(74.01,37.18) v1(74.01,35.91) v1(74.01,34.64) v1(74.01,33.37) v1(74.01,32.1) v1(74.01,30.83) v1(74.01,29.56) v1(74.01,28.29) v1(74.01,27.02) v1(74.01,25.75) v1(74.01,24.48) v1(74.01,23.21) v1(74.01,21.94) v1(74.01,20.67) v1(74.01,19.4) v1(74.01,18.13) v1(74.01,16.86) v1(74.01,15.59) v1(74.01,14.32) v1(74.01,13.05) v1(74.01,11.78) v1(74.01,10.51) v1(74.01,9.24) v1(74.01,7.97) v1(74.01,6.7) v1(74.01,5.43) v1(74.01,4.16) v1(74.01,2.89) v1(74.01,1.62)
A2_JTAG_TDO: length 8.9
  Top Layer w0.203: CN2.48 19.96,22.33 16.43,22.33 v1(15.57,21.48)
  Bottom Layer w0.203: H1.3 13.15,22.78 14.45,21.48 v1(15.57,21.48)
A3_JTAG_TDI: length 10.2
  Top Layer w0.203: CN2.47 15.9,22.78 v1(15.2,22.08)
  Bottom Layer w0.203: v1(15.2,22.08) 15.2,23.12 13.01,25.32 H1.4
B1_JTAG_TMS: length 8.7
  Top Layer w0.203: v1(15.97,20.88) 17.07,21.98 CN2.49
  Bottom Layer w0.203: H1.2 13.16,20.23 13.8,20.88 v1(15.97,20.88)
BAT_LED0: length 19
  Top Layer w0.203: R55.1 41.19,6.64 R56.2 41.11,7.92 39.95,9.08 39.95,10.15 38.38,11.73 33.59,11.73 32.51,12.8 32.51,17.47 33.03,17.98 CN1.59
BAT_LED1: length 16.4
  Top Layer w0.203: R57.1 37.72,6.63 R58.2 36.2,9.43 36.2,10.38 35.16,11.42 33.46,11.42 32.21,12.67 32.21,17.59 32.99,18.38 CN1.58
BAT_LED2: length 14.6
  Top Layer w0.203: CN1.57 32.96,18.78 31.91,17.72 31.91,10.27 R60.2 R59.1
BAT_LED3: length 14.5
  Top Layer w0.203: R61.1 R62.2 31.6,8.73 31.6,17.84 32.93,19.18 CN1.56
BLE_RST_N: length 13.1
  Top Layer w0.203: CN2.4 24.3,18.78 24.6,18.48 24.6,16.75 24,16.15 21.07,16.15 v1(19.4,14.48) 19.4,13.25 20.89,11.76 20.89,11.5
BLE_UART_CTS: length 16.4
  Top Layer w0.203: v1(17.47,14.7) 18.13,14.05 18.13,12.28 18.91,11.5 U6.11 ; v1(17.47,14.7) R65.2 ; v1(17.47,14.7) 18.5,15.73 20.15,15.73 21.1,16.68 23.67,16.68 24.22,17.23 24.22,18.08 23.92,18.38 CN2.3
BLE_UART_RTS: length 23.3
  Top Layer w0.203: CN2.5 24.7,19.18 25.45,18.43 25.45,16.55 v1(24.5,15.6) ; R66.2 v1(17.28,13.35) 17.82,12.8 17.82,12.15 19.7,10.28 21.15,10.28 22.09,11.21 22.09,11.5
  Bottom Layer w0.203: v1(17.28,13.35) 18.5,14.58 18.5,15.28 18.82,15.6 v1(24.5,15.6)
BLE_UART_RX: length 22.2
  Top Layer w0.203: R64.2 18.41,10.7 19.45,9.67 22.89,9.67 24.49,11.26 24.49,13.96 26.55,16.03 26.55,18.6 25.17,19.98 CN2.7
BLE_UART_TX: length 21.1
  Top Layer w0.203: CN2.6 25,19.58 26.25,18.33 26.25,16.15 23.29,13.19 U6.8 23.29,11.21 22.04,9.97 19.57,9.97 17.52,12.03 R63.2
BTN0: length 39.7
  Top Layer w0.203: D1.2 9.13,38.09 C34.2 ; C34.2 9.18,39.81 SW5.3 SW5.4 ; C34.2 10.08,38.04 10.77,37.35 10.77,35.4 11.88,34.3 16.6,34.3 20.17,30.73 29.36,30.73 32.91,27.18 CN1.36
BTN1: length 33.7
  Top Layer w0.203: C35.2 15.91,39.84 SW6.3 SW6.4 ; C35.2 15.85,38.09 D2.2 ; C35.2 16.83,38.04 17.5,37.38 17.5,33.93 20.39,31.03 29.49,31.03 32.94,27.58 CN1.35
BTN2: length 61.8
  Top Layer w0.203: v1(3.47,8.73) D3.2 1.38,8.73 C36.2 1.33,6.98 1.32,6.97 1.32,0.97 ; CN1.34 v1(35.05,27.98)
  Bottom Layer w0.203: v1(35.05,27.98) 33.42,26.35 33.42,20.73 29,16.3 5.72,16.3 5.05,16.98 2.05,16.98 1.4,16.33 1.4,11.73 3.47,9.65 v1(3.47,8.73)
BTN3: length 27
  Top Layer w0.203: C37.2 22.54,38.14 D4.2 ; C37.2 23.56,38.09 24.17,37.48 24.17,33.58 25.2,32.55 28.59,32.55 32.77,28.38 CN1.33 ; C37.2 22.59,39.89 SW8.3 SW8.4
BTN4: length 21.8
  Top Layer w0.203: C38.2 29.39,39.88 SW9.3 29.38,45.67 29.37,45.68 29.37,45.89 29.41,45.93 ; C38.2 29.34,38.14 D5.2 ; C38.2 30.26,38.09 30.88,37.48 30.88,30.7 32.8,28.78 CN1.32
C1_JTAG_TCK: length 11.2
  Top Layer w0.203: R69.1 15.73,20.15 v1(15.77,20.15) 17.07,20.15 18.5,21.58 CN2.50
  Bottom Layer w0.203: v1(15.77,20.15) 15.57,20.15 13.12,17.7 H1.1
CH0_ADC_SPI_CS: length 11.8
  Top Layer w0.203: U45.4 44.14,30.96 42.88,29.7 42.88,27.8 41.85,26.78 CN1.24
CH0_ADC_SPI_MISO: length 11.6
  Top Layer w0.203: U45.3 46.04,29.98 43.75,29.98 43.28,29.5 43.28,27.55 42.1,26.38 CN1.23
CH0_ADC_SPI_SCK: length 11.7
  Top Layer w0.203: U45.5 44.29,31.96 42.53,30.2 42.53,28.65 41.45,27.58 CN1.26
CH0_DAC_SPI_CS: length 12.9
  Top Layer w0.203: CN1.29 40.82,28.78 41.45,29.4 41.45,31.78 44.65,34.98 46.04,34.98 U45.8
CH0_DAC_SPI_MOSI: length 12.1
  Top Layer w0.203: CN1.27 41.32,27.98 42.17,28.83 42.17,30.7 44.44,32.96 U45.6
CH0_DAC_SPI_SCK: length 12.7
  Top Layer w0.203: U45.7 44.31,33.96 41.82,31.48 41.82,29.12 41.07,28.38 CN1.28
CH1_ADC_SPI_CS: length 33.5
  Top Layer w0.203: CN1.18 42.8,24.38 44.94,22.23 55.28,22.23 56.7,23.64 56.7,28.68 58.98,30.96 U46.4
CH1_ADC_SPI_MISO: length 33.2
  Top Layer w0.203: CN1.17 42.77,23.98 44.82,21.93 55.41,21.93 57,23.52 57,28.55 58.41,29.96 U46.3
CH1_ADC_SPI_SCK: length 33.8
  Top Layer w0.203: U46.5 59.55,31.96 56.39,28.8 56.39,23.77 55.15,22.54 45.07,22.54 42.83,24.78 CN1.19
CH1_DAC_SPI_CS: length 34.8
  Top Layer w0.203: U46.8 61.26,34.96 55.48,29.18 55.48,24.15 54.78,23.45 45.45,23.45 42.92,25.98 CN1.22
CH1_DAC_SPI_MOSI: length 34.2
  Top Layer w0.203: CN1.20 42.86,25.18 45.2,22.84 55.03,22.84 56.09,23.9 56.09,28.93 60.12,32.96 U46.6
CH1_DAC_SPI_SCK: length 34.5
  Top Layer w0.203: U46.7 60.69,33.96 55.78,29.06 55.78,24.02 54.9,23.15 45.32,23.15 42.89,25.58 CN1.21
CH2_ADC_SPI_CS: length 30.3
  Top Layer w0.203: U47.4 56.21,10.65 49.1,17.76 44.5,17.76 41.48,20.78 CN1.9
CH2_ADC_SPI_MISO: length 30.5
  Top Layer w0.203: U47.3 56.78,9.65 48.98,17.45 44.38,17.45 41.45,20.38 CN1.8
CH2_ADC_SPI_SCK: length 30
  Top Layer w0.203: CN1.10 41.51,21.18 44.63,18.06 49.23,18.06 55.64,11.65 U47.5
CH2_DAC_SPI_CS: length 29.8
  Top Layer w0.203: U47.8 57.38,14.65 50.55,21.48 44.83,21.48 42.74,23.58 CN1.16
CH2_DAC_SPI_MOSI: length 29.8
  Top Layer w0.203: CN1.11 41.54,21.58 44.75,18.37 49.35,18.37 55.07,12.65 U47.6
CH2_DAC_SPI_SCK: length 30
  Top Layer w0.203: CN1.15 42.71,23.18 44.71,21.18 50.43,21.18 57.95,13.65 U47.7
CH3_ADC_SPI_CS: length 14.9
  Top Layer w0.203: U48.4 43.62,10.65 42.93,11.34 42.93,16.03 40.58,18.38 CN1.3
CH3_ADC_SPI_MISO: length 15.4
  Top Layer w0.203: CN1.2 40.55,17.98 42.62,15.9 42.62,10.85 43.82,9.65 U48.3
CH3_ADC_SPI_SCK: length 14.1
  Top Layer w0.203: U48.5 44,11.65 43.23,12.42 43.23,16.15 40.61,18.78 CN1.4
CH3_DAC_SPI_CS: length 11.9
  Top Layer w0.203: U48.8 44.75,14.65 44.15,15.25 44.15,16.53 40.71,19.98 CN1.7
CH3_DAC_SPI_MOSI: length 13.4
  Top Layer w0.203: U48.6 44.2,12.65 43.54,13.31 43.54,16.28 40.64,19.18 CN1.5
CH3_DAC_SPI_SCK: length 12.8
  Top Layer w0.203: U48.7 44.25,13.65 43.84,14.06 43.84,16.41 40.68,19.58 CN1.6
D7_DONE: length 49
  Top Layer w0.203: CN1.48 33.96,22.33 33.41,22.33 28.92,17.85 v1(28.92,8.5) ; R42.1 R44.2 56.85,2.6 v1(56.85,3.08)
  Bottom Layer w0.203: v1(28.92,8.5) 34.35,3.08 v1(56.85,3.08)
E8_READY: length 36.1
  Top Layer w0.203: v1(29.5,9.2) 29.5,17.85 32.42,20.78 CN1.52 ; R41.1 R43.2 46.22,3.28 v1(45.78,3.73)
  Bottom Layer w0.203: v1(45.78,3.73) 34.97,3.73 v1(29.5,9.2)
LED1/I2C_INT: length 16.1
  Top Layer w0.203: v1(28.42,25.18) CN1.41
  Bottom Layer w0.203: v1(28.42,25.18) 21.32,25.18 19.77,23.62 U50.4
LED2/I2C_SCL: length 18.8
  Top Layer w0.203: CN1.43 30.03,24.38 v1(29.35,23.7)
  Bottom Layer w0.203: v1(29.35,23.7) 27.75,22.1 21.57,22.1 20.97,21.5 20.97,19.85 19.66,18.54 U50.8
M0_CK_N: length 14.6
  Top Layer w0.203: CN2.38 19.31,26.38 19.28,26.35 7.54,26.35 6.94,26.95 6.59,26.95 6.52,27.02 FPC1.12
M0_CK_P: length 14.6
  Top Layer w0.203: CN2.39 19.31,25.98 19.28,26 7.39,26 6.79,26.59 6.59,26.59 6.52,26.52 FPC1.13
M0_D0_N: length 14.9
  Top Layer w0.203: FPC1.6 6.52,30.02 6.59,29.95 6.94,29.95 8.14,28.75 19.28,28.75 19.31,28.78 CN2.32
M0_D0_P: length 14.9
  Top Layer w0.203: CN2.33 19.31,28.38 19.28,28.4 7.99,28.4 6.79,29.59 6.59,29.59 6.52,29.52 FPC1.7
M0_D1_N: length 14.7
  Top Layer w0.203: CN2.35 19.31,27.58 19.28,27.55 7.84,27.55 6.94,28.45 6.59,28.45 6.52,28.52 FPC1.9
M0_D1_P: length 14.7
  Top Layer w0.203: CN2.36 19.31,27.18 19.28,27.2 7.69,27.2 6.79,28.09 6.59,28.09 6.52,28.02 FPC1.10
M0_D2_N: length 14.5
  Top Layer w0.203: FPC1.15 6.52,25.52 6.59,25.45 6.94,25.45 7.24,25.15 19.28,25.15 19.31,25.18 CN2.41
M0_D2_P: length 14.5
  Top Layer w0.203: CN2.42 19.31,24.78 19.28,24.8 7.09,24.8 6.79,25.09 6.59,25.09 6.52,25.02 FPC1.16
M0_D3_N: length 14.4
  Top Layer w0.203: CN2.44 19.31,23.98 19.28,23.95 18.93,23.95 18.93,23.95 6.59,23.95 6.52,24.02 FPC1.18
M0_D3_P: length 14.4
  Top Layer w0.203: FPC1.19 6.52,23.52 6.59,23.59 19.08,23.59 19.08,23.6 19.28,23.6 19.31,23.58 CN2.45
PSET/I2C_SDA: length 17
  Top Layer w0.203: v1(28.53,23.95) 29.35,24.78 CN1.42
  Bottom Layer w0.203: v1(28.53,23.95) 27.17,22.6 21.17,22.6 19.66,21.08 U50.6
RGB_B: length 17.3
  Top Layer w0.203: R50.1 R52.2 9.1,12.04 9.1,14.23 13.65,18.78 CN2.57
RGB_G: length 16.3
  Top Layer w0.203: R53.1 R54.2 10.57,12.01 10.57,15.27 13.68,18.38 CN2.58
RGB_R: length 15.2
  Top Layer w0.203: R49.1 R51.2 12.4,12.33 12.4,16.66 13.71,17.98 CN2.59
VCCIO0/1: length 3.4
  Top Layer w0.254: CN1.13 L1.2 38.32,21.98 CN1.12
VCCIO2/3: length 9.5
  Top Layer w0.254: 21.92,17.58 21.35,17.58 19.92,16.15 L2.2 ; 21.92,17.58 22.32,17.98 CN2.2 ; 21.92,17.58 CN2.1
VCCIO6/7: length 13
  Top Layer w0.254: 35.32,23.18 35.72,22.78 35.72,16.28 37,15 L3.2 ; 35.32,23.18 CN1.46 ; 35.32,23.18 34.92,23.58 CN1.45
VSYS: length 60
  Top Layer w0.508: U47.10 67.38,16.65 69.17,18.45 69.17,36.35 68.56,36.96 U46.10 58.69,36.96 53.9,32.18 ; v1(48.22,16.65) v1(47.47,16.65) U48.10 ; C33.2 40.88,41.34 45.25,36.96 U45.10 48.06,36.96 48.57,36.45 48.57,32.75 49.62,31.7
  vias: v1(49.31,31.12) v1(49.31,29.85) v1(49.31,28.58) v1(50.58,31.12) v1(50.58,29.85) v1(50.58,28.58) v1(51.85,31.12) v1(51.85,29.85) v1(51.85,28.58) v1(53.12,31.12) v1(53.12,29.85) v1(53.12,28.58)
$1N10: length 3.2
  Top Layer w0.203: R39.2 R38.1 33.99,41.8 U2.2
$2N63: length 1.7
  Top Layer w0.203: R41.2 LED2.2
$2N64: length 1.7
  Top Layer w0.203: R42.2 LED3.2
$2N74: length 7.9
  Top Layer w0.203: R45.2 SW5.1 SW5.2
$2N77: length 7.9
  Top Layer w0.203: SW6.2 SW6.1 12.2,39.85 R46.2
$2N82: length 7.9
  Top Layer w0.203: SW7.2 SW7.1 5.02,8.85 R47.2
$2N87: length 7.9
  Top Layer w0.203: SW8.2 SW8.1 R48.2
$2N174: length 2.4
  Top Layer w0.203: LED1.3 8.34,8.5 R50.2
$2N175: length 2.4
  Top Layer w0.203: R49.2 11.34,6.07
$2N176: length 2.4
  Top Layer w0.203: R53.2 LED1.2
$2N180: length 1.6
  Top Layer w0.203: R55.2 LED4.2
$2N183: length 1.6
  Top Layer w0.203: R57.2 LED5.2
$2N186: length 1.6
  Top Layer w0.203: R59.2 LED6.2
$2N189: length 1.6
  Top Layer w0.203: R61.2 LED7.2
$2N202: length 7.9
  Top Layer w0.203: SW9.2 SW9.1 25.69,39.89 R68.2
$9N14: length 10.3
  Top Layer w0.203: LED8.1 14.99,1.51 16.17,2.7 16.17,8.88 16.9,9.6 U6.12
$9N15: length 2.2
  Top Layer w0.203: LED8.2 R67.1

## Copper pours and planes (outline as drawn; the poured copper is in the pictures)
3V3 on Top Layer: 22.57,27.23 29.06,27.23 29.06,26.31 22.57,26.31
3V3 on Bottom Layer: 26.03,27.35 29.07,27.35 29.07,26.18 26.03,26.18
+5V on Top Layer: 22.15,30.1 25.03,30.1 25.03,27.53 22.15,27.53
+5V on Top Layer: 33.17,40.74 36.56,40.74 36.56,35.35 33.17,35.35
+5V on Bottom Layer: 33.17,39.32 36.66,39.32 36.66,35.38 33.17,35.38
+5V on Bottom Layer: 22.15,30.1 25.03,30.1 25.03,27.85 22.15,27.85
GND on Top Layer: 0,46.8 76.95,46.8 76.95,0 0,0
GND on Bottom Layer: 0,46.8 76.7,46.8 76.7,0 0,0
GND on Inner1: 0,46.8 76.17,46.8 76.17,0 0,0
GND on Inner2: 0,46.8 76.62,46.8 76.62,0 0,0
VSYS on Top Layer: 48.72,32.46 54.03,32.46 54.03,27.98 48.72,27.98
VSYS on Top Layer: 37.9,44.66 41.6,44.66 41.6,40.83 37.9,40.83
VSYS on Bottom Layer: 44.12,16.23 44.12,32.45 54.03,32.45 54.03,27.96 48.68,27.96 48.68,16.23
$1N5 on Top Layer: 37.7,45.07 39.35,45.07 39.35,42.6 37.7,42.6

Small or netless copper shapes (teardrops, artwork), in the pictures only: 242 on Top Layer, 23 on Bottom Layer

## Text on the board
Bottom Silkscreen Layer: ECE 455 | Brain Stimulator #1 Main Cntrl | JTAG | VSYS
Top Silkscreen Layer: FPGA | v0.1 | CH0 | CH3 | CH2 | CH1
